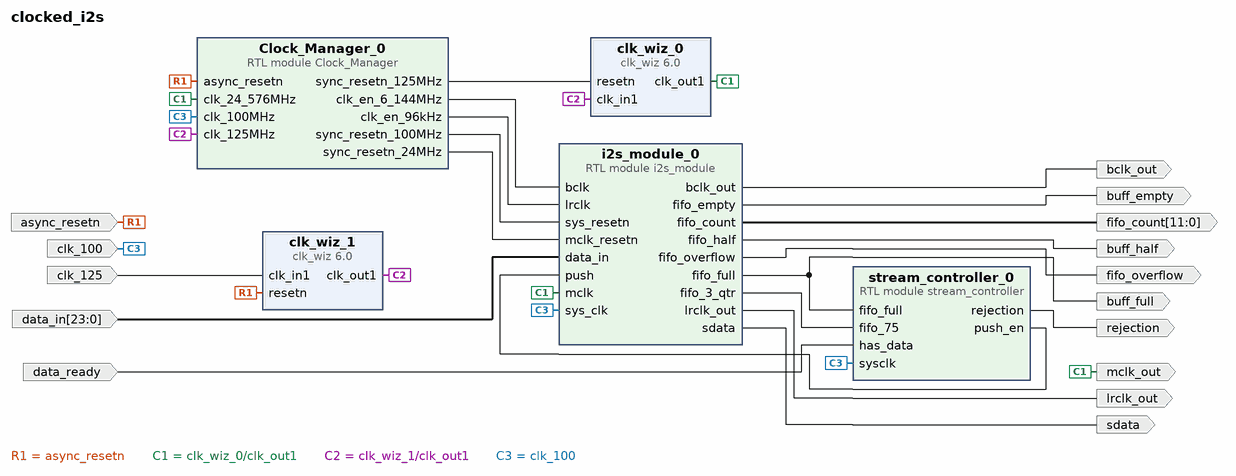
[diagram p0: block diagram of the top level]
# Vivado block design clocked_i2s, xc7z020clg400-1, Vivado 2021.1
create_bd_design clocked_i2s

create_bd_port -dir I -type clk clk_125
set_property -dict {CONFIG.FREQ_HZ 125000000} [get_bd_ports clk_125]
create_bd_port -dir I data_ready
create_bd_port -dir I -from 23 -to 0 data_in
create_bd_port -dir O fifo_overflow
create_bd_port -dir O -from 11 -to 0 fifo_count
create_bd_port -dir I clk_100
create_bd_port -dir I -type rst async_resetn
create_bd_port -dir O lrclk_out
create_bd_port -dir O bclk_out
create_bd_port -dir O sdata
create_bd_port -dir O -type clk mclk_out
create_bd_port -dir O -type intr buff_full
create_bd_port -dir O -type intr buff_half
create_bd_port -dir O -type data buff_empty
create_bd_port -dir O rejection

create_bd_cell -type ip -vlnv xilinx.com:ip:clk_wiz:6.0 clk_wiz_0
set_property -dict [list \
  CONFIG.CLKIN1_JITTER_PS 80.0 \
  CONFIG.CLKOUT1_DRIVES BUFG \
  CONFIG.CLKOUT1_JITTER 554.143 \
  CONFIG.CLKOUT1_PHASE_ERROR 432.485 \
  CONFIG.CLKOUT1_REQUESTED_OUT_FREQ 24.57601 \
  CONFIG.FEEDBACK_SOURCE FDBK_AUTO \
  CONFIG.MMCM_CLKFBOUT_MULT_F 39.125 \
  CONFIG.MMCM_CLKIN1_PERIOD 8.000 \
  CONFIG.MMCM_CLKIN2_PERIOD 10.0 \
  CONFIG.MMCM_CLKOUT0_DIVIDE_F 24.875 \
  CONFIG.MMCM_DIVCLK_DIVIDE 8 \
  CONFIG.PRIM_IN_FREQ 125 \
  CONFIG.RESET_PORT resetn \
  CONFIG.RESET_TYPE ACTIVE_LOW \
  CONFIG.USE_LOCKED false \
] [get_bd_cells clk_wiz_0]
create_bd_cell -type module -reference Clock_Manager Clock_Manager_0
create_bd_cell -type module -reference i2s_module i2s_module_0
create_bd_cell -type module -reference stream_controller stream_controller_0
create_bd_cell -type ip -vlnv xilinx.com:ip:clk_wiz:6.0 clk_wiz_1
set_property -dict [list \
  CONFIG.CLKIN1_JITTER_PS 800.0 \
  CONFIG.CLKIN1_UI_JITTER 0.100 \
  CONFIG.CLKOUT1_DRIVES BUFG \
  CONFIG.CLKOUT1_JITTER 124.057 \
  CONFIG.CLKOUT1_PHASE_ERROR 312.996 \
  CONFIG.CLKOUT1_REQUESTED_OUT_FREQ 125 \
  CONFIG.CLKOUT2_DRIVES BUFG \
  CONFIG.CLKOUT3_DRIVES BUFG \
  CONFIG.CLKOUT4_DRIVES BUFG \
  CONFIG.CLKOUT5_DRIVES BUFG \
  CONFIG.CLKOUT6_DRIVES BUFG \
  CONFIG.CLKOUT7_DRIVES BUFG \
  CONFIG.JITTER_SEL Max_I_Jitter \
  CONFIG.MMCM_BANDWIDTH LOW \
  CONFIG.MMCM_CLKFBOUT_MULT_F 7 \
  CONFIG.MMCM_CLKIN1_PERIOD 8.000 \
  CONFIG.MMCM_CLKIN2_PERIOD 10.0 \
  CONFIG.MMCM_CLKOUT0_DIVIDE_F 7 \
  CONFIG.MMCM_COMPENSATION ZHOLD \
  CONFIG.MMCM_REF_JITTER1 0.100 \
  CONFIG.PRIMITIVE PLL \
  CONFIG.PRIM_IN_FREQ 125 \
  CONFIG.RESET_PORT resetn \
  CONFIG.RESET_TYPE ACTIVE_LOW \
  CONFIG.USE_LOCKED false \
] [get_bd_cells clk_wiz_1]

# ---- connections ----

connect_bd_net -net Clock_Manager_0_clk_en_12_288MHz [get_bd_pins Clock_Manager_0/clk_en_6_144MHz] [get_bd_pins i2s_module_0/bclk]
connect_bd_net [get_bd_pins Clock_Manager_0/clk_en_96kHz] [get_bd_pins i2s_module_0/lrclk]
connect_bd_net [get_bd_pins Clock_Manager_0/sync_resetn_100MHz] [get_bd_pins i2s_module_0/sys_resetn]
connect_bd_net [get_bd_pins Clock_Manager_0/sync_resetn_125MHz] [get_bd_pins clk_wiz_0/resetn]
connect_bd_net [get_bd_pins Clock_Manager_0/sync_resetn_24MHz] [get_bd_pins i2s_module_0/mclk_resetn]
connect_bd_net -net async_resetn_0_1 [get_bd_ports async_resetn] [get_bd_pins Clock_Manager_0/async_resetn] [get_bd_pins clk_wiz_1/resetn]
connect_bd_net -net clk_125_1 [get_bd_ports clk_125] [get_bd_pins clk_wiz_1/clk_in1]
connect_bd_net [get_bd_pins clk_wiz_0/clk_out1] [get_bd_pins Clock_Manager_0/clk_24_576MHz] [get_bd_ports mclk_out] [get_bd_pins i2s_module_0/mclk]
connect_bd_net [get_bd_pins clk_wiz_1/clk_out1] [get_bd_pins clk_wiz_0/clk_in1] [get_bd_pins Clock_Manager_0/clk_125MHz]
connect_bd_net -net data_in_0_1 [get_bd_ports data_in] [get_bd_pins i2s_module_0/data_in]
connect_bd_net -net has_data_1 [get_bd_ports data_ready] [get_bd_pins stream_controller_0/has_data]
connect_bd_net [get_bd_pins i2s_module_0/bclk_out] [get_bd_ports bclk_out]
connect_bd_net [get_bd_pins i2s_module_0/fifo_3_qtr] [get_bd_pins stream_controller_0/fifo_75]
connect_bd_net [get_bd_pins i2s_module_0/fifo_count] [get_bd_ports fifo_count]
connect_bd_net [get_bd_pins i2s_module_0/fifo_empty] [get_bd_ports buff_empty]
connect_bd_net [get_bd_pins i2s_module_0/fifo_full] [get_bd_ports buff_full] [get_bd_pins stream_controller_0/fifo_full]
connect_bd_net [get_bd_pins i2s_module_0/fifo_half] [get_bd_ports buff_half]
connect_bd_net [get_bd_pins i2s_module_0/fifo_overflow] [get_bd_ports fifo_overflow]
connect_bd_net [get_bd_pins i2s_module_0/lrclk_out] [get_bd_ports lrclk_out]
connect_bd_net [get_bd_pins i2s_module_0/sdata] [get_bd_ports sdata]
connect_bd_net -net pl_clk_1 [get_bd_ports clk_100] \
  [get_bd_pins Clock_Manager_0/clk_100MHz] [get_bd_pins i2s_module_0/sys_clk] [get_bd_pins stream_controller_0/sysclk]
connect_bd_net [get_bd_pins stream_controller_0/push_en] [get_bd_pins i2s_module_0/push]
connect_bd_net [get_bd_pins stream_controller_0/rejection] [get_bd_ports rejection]

validate_bd_design
save_bd_design
